# Altium project ps2-blueretro.PrjPcb
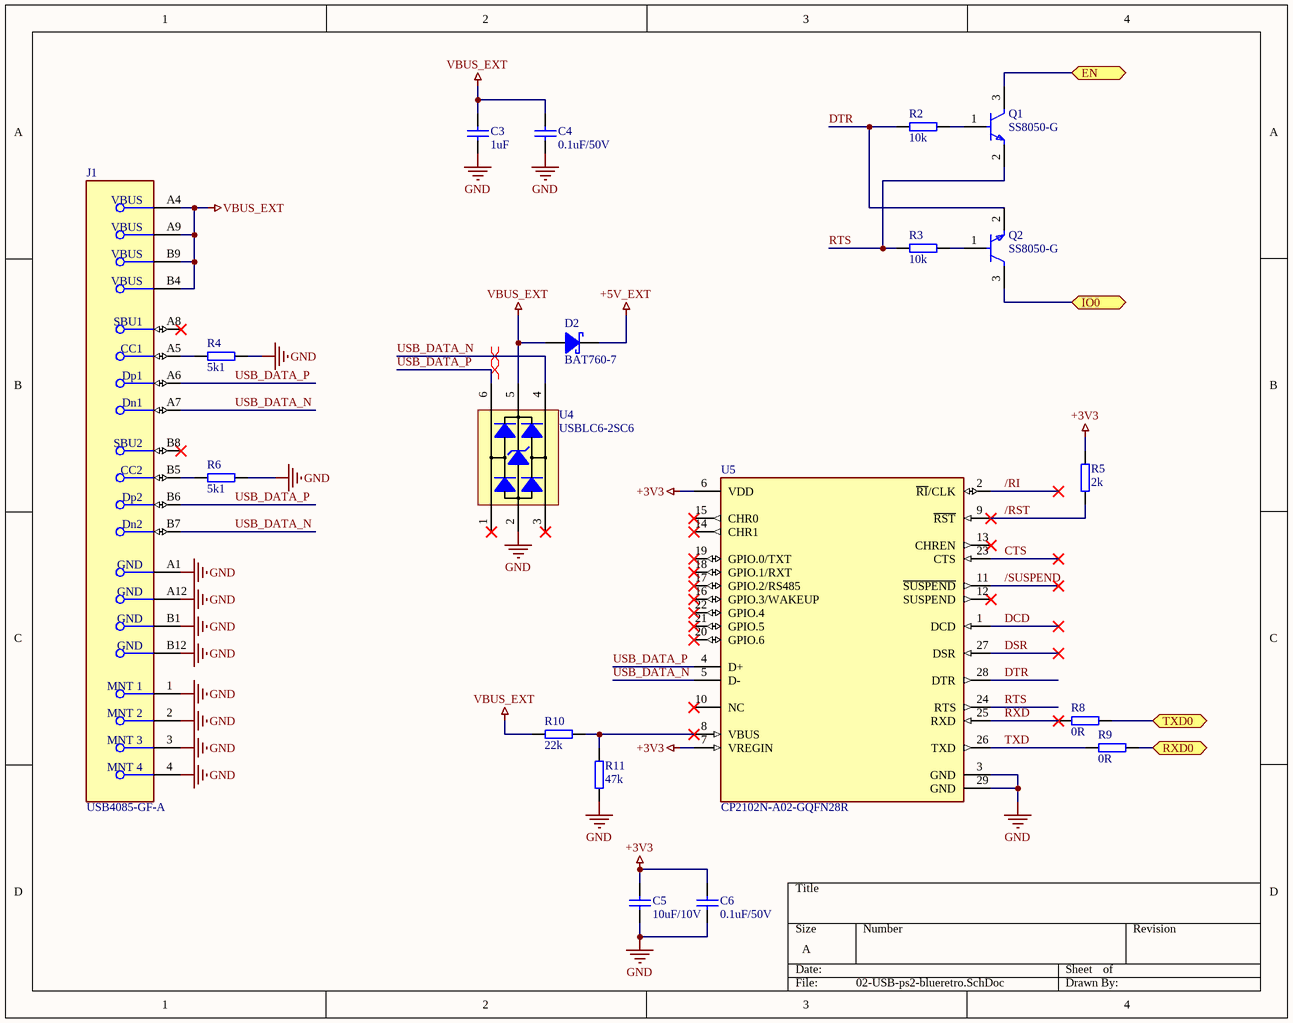
[diagram p0: 02-USB-ps2-blueretro.SchDoc]
7 sheets, 65 parts. Net scope: hierarchical (ports join the sheet entries above them; power ports are global).
Board file: ps2-blueretro.PcbDoc
Sheets:
  02-USB-ps2-blueretro.SchDoc
  00-ps2-blueretro.SchDoc
    U_01-ESP32-ps2-blueretro = 01-ESP32-ps2-blueretro.SchDoc
  03-PSU-ps2-blueretro.SchDoc
  04-CTRL1-ps2-blueretro.SchDoc
  05-CTRL2-ps2-blueretro.SchDoc
  06-DETECT-ps2-blueretro.SchDoc

## Sheet 02-USB-ps2-blueretro.SchDoc
size A; SheetNumber: 3; SheetTotal: 7

### Parts
(Parts that share a designator on the sheet are numbered #1, #2 ... from top to bottom, then left to right.)
C3#1  value 1uF  [cap_0603]  (hidden comment: cap_0603)
C4#1  value 0.1uF/50V  [cap_0603]  (hidden comment: cap_0603)
C5#1  value 10uF/10V  [cap_0603]  (hidden comment: cap_0603)
C6#1  value 0.1uF/50V  [cap_0603]  (hidden comment: cap_0603)
D2  BAT760-7  [sod-323]
J1  USB4085-GF-A  [FP-USB4085-GF-A-MFG]
Q1  SS8050-G  [FP-SS8050-G-MFG]
Q2  SS8050-G  [FP-SS8050-G-MFG]
R2#1  value 10k  [res_0603]  (hidden comment: res_0603)
R3#1  value 10k  [res_0603]  (hidden comment: res_0603)
R4#1  value 5k1  [res_0603]  (hidden comment: res_0603)
R5  value 2k  [res_0603]  (hidden comment: res_0603)
R6  value 5k1  [res_0603]  (hidden comment: res_0603)
R8  value 0R  [res_0603]  (hidden comment: res_0603)
R9  value 0R  [res_0603]  (hidden comment: res_0603)
R10  value 22k  [res_0603]  (hidden comment: res_0603)
R11  value 47k  [res_0603]  (hidden comment: res_0603)
U4  USBLC6-2SC6  [sot23-6l]
U5  CP2102N-A02-GQFN28R  [FP-CP2102N-A02-GQFN28R-MFG]

### Ports
EN (bidir, see 00-ps2-blueretro[3C], 01-ESP32-ps2-blueretro[3B]), IO0 (bidir, see 00-ps2-blueretro[3C], 01-ESP32-ps2-blueretro[1A]), RXD0 (bidir, see 00-ps2-blueretro[3B], 01-ESP32-ps2-blueretro[2B]), TXD0 (bidir, see 00-ps2-blueretro[3C], 01-ESP32-ps2-blueretro[2B])

### Nets
+3V3: C5#1.2 C6#1.2 R5.1 U5.6(VDD) U5.7(VREGIN)
+5V_EXT: D2.1(K)
GND: C3#1.1 C4#1.1 C5#1.1 C6#1.1 J1.1(MNT_1) J1.2(MNT_2) J1.3(MNT_3) J1.4(MNT_4) J1.A1(GND) J1.A12(GND) J1.B1(GND) J1.B12(GND) R4#1.1 R6.1 R11.2 U4.2 U5.3(GND) U5.29(GND)
VBUS_EXT: C3#1.2 C4#1.2 D2.2(A) J1.A4(VBUS) J1.A9(VBUS) J1.B4(VBUS) J1.B9(VBUS) R10.2 U4.5
/RI: U5.2(~{RI}/CLK)
/RST: R5.2 U5.9(~{RST})
/SUSPEND: U5.11(~{SUSPEND})
CTS: U5.23(CTS)
DCD: U5.1(DCD)
DSR: U5.27(DSR)
DTR: Q2.2(E) R2#1.1 U5.28(DTR)
RTS: Q1.2(E) R3#1.1 U5.24(RTS)
RXD: R8.2 U5.25(RXD)
TXD: R9.2 U5.26(TXD)
USB_DATA_N: J1.A7(Dn1) J1.B7(Dn2) U4.4 U5.5(D-)
USB_DATA_P: J1.A6(Dp1) J1.B6(Dp2) U4.6 U5.4(D+)
NetJ1_A5: J1.A5(CC1) R4#1.2
NetJ1_B5: J1.B5(CC2) R6.2
NetQ1_1: Q1.1(B) R2#1.2
NetQ1_3: Q1.3(C) ; port EN
NetQ2_1: Q2.1(B) R3#1.2
NetQ2_3: Q2.3(C) ; port IO0
NetR8_1: R8.1 ; port TXD0
NetR9_1: R9.1 ; port RXD0
NetR10_1: R10.1 R11.1 U5.8(VBUS)

Not connected (* = marked no-connect by the designer): J1 A8(SBU1)* B8(SBU2)*; U4 1* 3*; U5 10(NC)* 12(SUSPEND)* 13(CHREN)* 14(CHR1)* 15(CHR0)* 16(GPIO.3/WAKEUP)* 17(GPIO.2/RS485)* 18(GPIO.1/RXT)* 19(GPIO.0/TXT)* 20(GPIO.6)* 21(GPIO.5)* 22(GPIO.4)*

### Layout directives
differential pair: USB_DATA_N, USB_DATA_P

### Library data of the parts
D2 = BAT760-7: 30V 1A, Vf=495mV @ 1A, Ir=50µA @ 15V Schottky Diode; Manufacturer: Diodes Incorporated; Supplier: Digikey; Price: 0,48; Manufacturer Part Number: BAT760-7; Supplier Part Number: BAT760DICT-ND; ComponentLink1Description: Supplier Link; ComponentLink1URL: https://www.digikey.at/de/products/detail/diodes-incorporated/BAT760-7/697106; ComponentLink2Description: Manufacturer Link; ComponentLink2URL: *; ComponentLink3Description: Datasheet Link; ComponentLink3URL: https://www.diodes.com/assets/Datasheets/BAT760.pdf
J1 = CMP-196119-000001-2: CONN RCPT USB2.0 TYPE C 24POS RA; Gender: Receptacle; Number of Positions: 16; USB Standard: USB 2.0; Orientation: Right Angle; Contact Plating: Gold; Contact Material: Copper Alloy
Q1 Q2 = CMP-20235-000001-1: NPN TRANSISTOR 1.5A 40V SOT-23 R; Transition Frequency: 100MHz; Max Breakdown Voltage: 25V; Collector Emitter Voltage (VCEO): 400mV; Max Power Dissipation: 300mW; Max Collector Current: 1.5A; Case/Package: TO-236-3; Packaging: Tape and Reel; RoHS Compliant: Yes; Mount: Surface Mount; Collector Emitter Breakdown Voltage: 25V
U4 = USBLC6-2SC6: 2.5V 5A, Vf=1.1V @ 10mA, Ir=6µA @ 2.5V ESD Protection Diode; Manufacturer: STMicroelectronics; Supplier: Digikey; Price: 0,32; Manufacturer Part Number: USBLC6-2SC6; Supplier Part Number: 497-5235-1-ND; ComponentLink1Description: Supplier Link; ComponentLink1URL: https://www.digikey.at/de/products/detail/stmicroelectronics/USBLC6-2SC6/1040559; ComponentLink2Description: Manufacturer Link; ComponentLink2URL: *; ComponentLink3Description: Datasheet Link; ComponentLink3URL: https://www.st.com/content/ccc/resource/technical/document/datasheet/06/1d/48/9c/6c/20/4a/b2/CD00050750.pdf/files/CD00050750.pdf/jcr:content/translations/en.CD00050750.pdf
U5 = CMP-08093-000007-1: IC USB TO UART BRIDGE QFN28

## Sheet 00-ps2-blueretro.SchDoc
size A; SheetNumber: 1; SheetTotal: 5
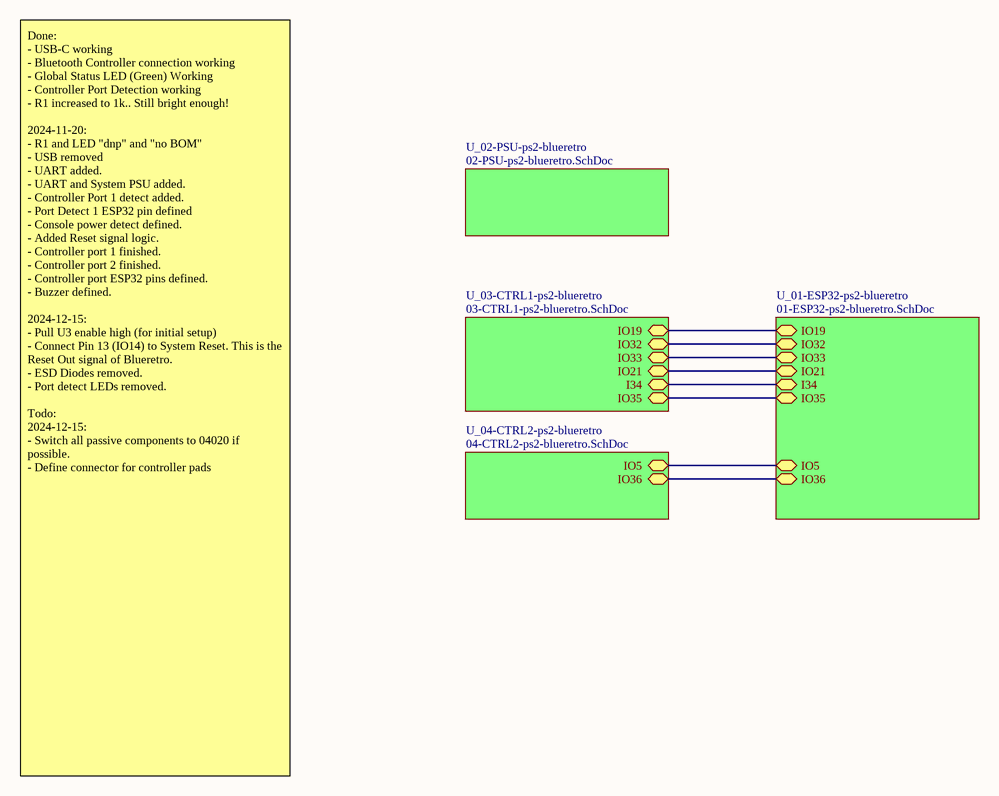
[diagram p1: 00-ps2-blueretro.SchDoc]

### Sub-sheets
U_01-ESP32-ps2-blueretro = 01-ESP32-ps2-blueretro.SchDoc: IO19 (bidir), IO32 (bidir), I34 (bidir), IO33 (bidir), IO21 (bidir), IO35 (bidir), IO5 (bidir), IO36 (bidir)
U_02-PSU-ps2-blueretro = 02-PSU-ps2-blueretro.SchDoc (file not in this document): no entries
U_03-CTRL1-ps2-blueretro = 03-CTRL1-ps2-blueretro.SchDoc (file not in this document): IO19 (bidir), IO32 (bidir), IO33 (bidir), IO21 (bidir), I34 (bidir), IO35 (bidir)
U_04-CTRL2-ps2-blueretro = 04-CTRL2-ps2-blueretro.SchDoc (file not in this document): IO5 (bidir), IO36 (bidir)

### Nets
IO22: sheet U_01-ESP32-ps2-blueretro/IO19, sheet U_03-CTRL1-ps2-blueretro/IO19
IO25: sheet U_01-ESP32-ps2-blueretro/IO21, sheet U_03-CTRL1-ps2-blueretro/IO21
IO26: sheet U_01-ESP32-ps2-blueretro/IO33, sheet U_03-CTRL1-ps2-blueretro/IO33
IO27: sheet U_01-ESP32-ps2-blueretro/IO32, sheet U_03-CTRL1-ps2-blueretro/IO32
NetU1_4: sheet U_01-ESP32-ps2-blueretro/IO36, sheet U_04-CTRL2-ps2-blueretro/IO36
NetU1_6: sheet U_01-ESP32-ps2-blueretro/I34, sheet U_03-CTRL1-ps2-blueretro/I34
NetU1_7: sheet U_01-ESP32-ps2-blueretro/IO35, sheet U_03-CTRL1-ps2-blueretro/IO35
NetU1_29: sheet U_01-ESP32-ps2-blueretro/IO5, sheet U_04-CTRL2-ps2-blueretro/IO5

### Notes on the sheet
- Done:
  - USB-C working
  - Bluetooth Controller connection working
  - Global Status LED (Green) Working
  - Controller Port Detection working
  - R1 increased to 1k.. Still bright enough!
  2024-11-20:
  - R1 and LED "dnp" and "no BOM"
  - USB removed
  - UART added.
  - UART and System PSU added.
  - Controller Port 1 detect added.
  - Port Detect 1 ESP32 pin defined
  - Console power detect defined.
  - Added Reset signal logic.
  - Controller port 1 finished.
  - Controller port 2 finished.
  - Controller port ESP32 pins defined.
  - Buzzer defined.
  2024-12-15:
  - Pull U3 enable high (for initial setup)
  - Connect Pin 13 (IO14) to System Reset. This is the Reset Out signal of Blueretro.
  - ESD Diodes removed.
  - Port detect LEDs removed.
  Todo:
  2024-12-15:
  - Switch all passive components to 04020 if possible.
  - Define connector for controller pads

## Sheet 01-ESP32-ps2-blueretro.SchDoc
size A4; SheetNumber: 2; SheetTotal: 6
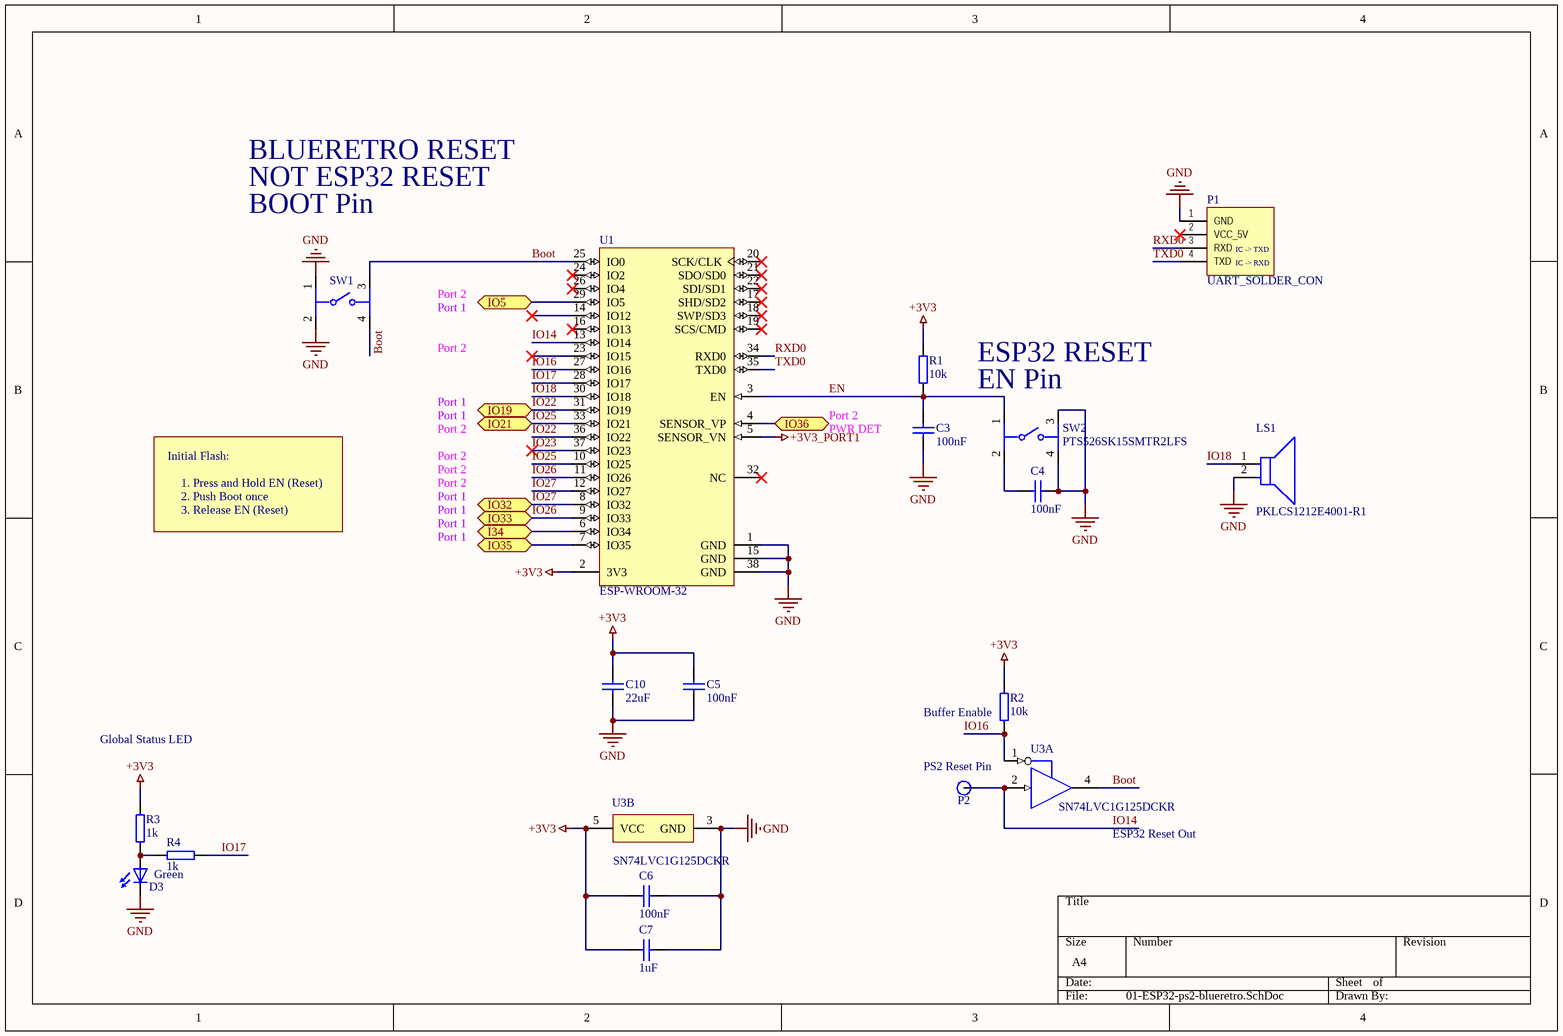
[diagram p2: 01-ESP32-ps2-blueretro.SchDoc]

### Parts
(Parts that share a designator on the sheet are numbered #1, #2 ... from top to bottom, then left to right.)
C3#2  value 100nF  [res_0402]  (hidden comment: cap_0402)
C4#2  value 100nF  [res_0402]  (hidden comment: cap_0402)
C5#2  value 100nF  [res_0402]  (hidden comment: cap_0402)
C6#2  value 100nF  [res_0402]  (hidden comment: cap_0402)
C7  value 1uF  [res_0402]  (hidden comment: cap_0402)
C10  value 22uF  [cap_0603]  (hidden comment: cap_0603)
D3  value Green  [led0603_GREEN]  (hidden comment: led_0603)
LS1  PKLCS1212E4001-R1  [FP-PKLCS1212E4001-R1-MFG]
P1  UART_SOLDER_CON  [UART_SOLDER_CON]  (no BOM)
P2  Solder_Contact_2mm  [SINGLE_SOLDER_CON]  (value not drawn)
R1#1  value 10k  [res_0402]  (hidden comment: res_0402)
R2#2  value 10k  [res_0402]  (hidden comment: res_0402)
R3#2  value 1k  [res_0402]  (hidden comment: res_0402)
R4#2  value 1k  [res_0402]  (hidden comment: res_0402)
SW1  PTS526SK15SMTR2LFS  [FP-PTS526SK15SMTR2LFS-MFG]  (value not drawn)
SW2  PTS526SK15SMTR2LFS  [FP-PTS526SK15SMTR2LFS-MFG]
U1  ESP-WROOM-32  [OLMX-ESP-WROOM-32]
U3  SN74LVC1G125DCKR  [DCK0005A_M]  (parts A,B of 2)

### Ports
I34 (bidir, see 00-ps2-blueretro[3B], 03-CTRL1-ps2-blueretro[2B]), IO5 (bidir, see 00-ps2-blueretro[3C], 04-CTRL2-ps2-blueretro[2B]), IO19 (bidir, see 00-ps2-blueretro[3B], 03-CTRL1-ps2-blueretro[2A]), IO21 (bidir, see 00-ps2-blueretro[3B], 03-CTRL1-ps2-blueretro[2B]), IO32 (bidir, see 00-ps2-blueretro[3B], 03-CTRL1-ps2-blueretro[2A]), IO33 (bidir, see 00-ps2-blueretro[3B], 03-CTRL1-ps2-blueretro[2B]), IO35 (bidir, see 00-ps2-blueretro[3B], 03-CTRL1-ps2-blueretro[2C]), IO36 (bidir, see 00-ps2-blueretro[3C], 04-CTRL2-ps2-blueretro[2C])

### Nets
+3V3: C5#2.2 C6#2.2 C7.2 C10.2 R1#1.2 R2#2.2 R3#2.2 U1.2(3V3) U3.5(VCC)
+3V3_PORT1: U1.5(SENSOR_VN)
GND: C3#2.2 C4#2.2 C5#2.1 C6#2.1 C7.1 C10.1 D3.2(C) LS1.2 P1.1(GND) SW1.1 SW1.2 SW2.3 SW2.4 U1.1(GND) U1.15(GND) U1.38(GND) U3.3(GND)
Boot: SW1.3 SW1.4 U1.25(IO0) U3.4(Y)
EN: C3#2.1 R1#1.1 SW2.1 U1.3(EN)
IO14: P2.1 U1.13(IO14) U3.2(A)
IO16: R2#2.1 U1.27(IO16) U3.1(~{OE})
IO17: R4#2.1 U1.28(IO17)
IO18: LS1.1 U1.30(IO18)
IO22: U1.31(IO19) U1.36(IO22) ; port IO19
IO23: U1.37(IO23)
IO25: U1.10(IO25) U1.33(IO21) ; port IO21
IO26: U1.9(IO33) U1.11(IO26) ; port IO33
IO27: U1.8(IO32) U1.12(IO27) ; port IO32
RXD0: P1.3(RXD) U1.34(RXD0)
TXD0: P1.4(TXD) U1.35(TXD0)
NetC4#2_1: C4#2.1 SW2.2
NetD3_1: D3.1(A) R3#2.1 R4#2.2
NetU1_4: U1.4(SENSOR_VP) ; port IO36
NetU1_6: U1.6(IO34) ; port I34
NetU1_7: U1.7(IO35) ; port IO35
NetU1_29: U1.29(IO5) ; port IO5

Not connected (* = marked no-connect by the designer): P1 2(VCC_5V)*; U1 14(IO12)* 16(IO13)* 17(SHD/SD2)* 18(SWP/SD3)* 19(SCS/CMD)* 20(SCK/CLK)* 21(SDO/SD0)* 22(SDI/SD1)* 23(IO15)* 24(IO2)* 26(IO4)* 32(NC)*

### Notes on the sheet
- BLUERETRO RESET
- BOOT Pin
- NOT ESP32 RESET
- Port 1
- Port 2
- ESP32 RESET
- PWR DET
- EN Pin
- Initial Flash:
- 1. Press and Hold EN (Reset)
- 2. Push Boot once
- 3. Release EN (Reset)
- (near R2#2) Buffer Enable
- Global Status LED
- (near P2) PS2 Reset Pin
- ESP32 Reset Out
- (in symbol UART_SOLDER_CON) IC -> TXD; IC -> RXD

### Library data of the parts
D3 = led_0603: Green 3,2V 20mA; Manufacturer: Würth Elektronik; Manufacturer Part Number: 150060GS75000; Supplier: Digikey; Price: 0,14; Supplier Part Number: 732-4971-1-ND; ComponentLink1Description: Supplier Link; ComponentLink1URL: https://www.digikey.at/de/products/detail/w%C3%BCrth-elektronik/150060GS75000/4489898; ComponentLink2Description: Manufacturer Link; ComponentLink2URL: *; ComponentLink3Description: Datasheet Link; ComponentLink3URL: https://www.we-online.com/components/products/datasheet/150060GS75000.pdf
LS1 = CMP-2000-05277-2: AUDIO PIEZO TRANSDUCER 25V SMD; Self Resonant Frequency: 4kHz; Nominal Input Voltage: 3V; Washable: No; Diameter: 12mm; Min Operating Temperature: -20°C; Lead Free: Lead Free; Voltage Rating: 25V; Radiation Hardening: No; Max Supply Voltage: 25V; Package Quantity: 1; Max Frequency: 4kHz; Width: 12mm; Voltage Rating (DC): 25V; Packaging: Tape and Reel; Max Operating Temperature: 70°C; Frequency: 4kHz; Length: 12mm; Height: 3mm; Termination: Solder; REACH SVHC: No SVHC; Depth: 12mm; Mount: Surface Mount
SW1 SW2 = CMP-10040-000013-1: TACT 5.2 X 5.2, 1.5 MM H, 260GF,; Manufacturer: C&K; Operating Force: 250gf; Throw Configuration: SPST-NO; Contact Current Rating: 50mA; Standoff Height: 0mm; Contact Resistance: 100mΩ; Voltage Rating Dc: 12V; Electromechanical Life: 200000Cycles; Device Class L3: Tactile Switches; Device Class L2: Switches; Temperature: -20°C to +70°C; Temperature Range Low: -20°C; Package: PTS526SK15SMTR2LFS; Temperature Range High: +70°C; ComponentLink2Description: Datasheet; Device Class L1: Electromechanical; Height: 1.65mm; Digikey Description: TACT 5.2 X 5.2, 1.5 MM H, 260GF,; Category: Switch; RoHS: TRUE; Automotive: No; Lead Free: Yes; Manufacturer Part Number: PTS526SK15SMTR2LFS; Octopart: https://octopart.com/pts526+sk15+smtr2+lfs-c%26k+components-100617999; ComponentLink2URL: https://www.ckswitches.com/media/2780/pts526.pdf
U1 = CMP-2000-07454-1: Espressif System, 2.7 to 3.6 V, -40 to 85 degC, 38-Pin SMD; Manufacturer: Olimex; Package Description: 38-Pin Surface Mount Device, Body 18 x 25.5 mm, Pitch 1.27 mm; Manufacturer URL: https://www.olimex.com; RoHSCompliant: false; Mounting Technology: SurfaceMount; Datasheet Version: Rev. 2.1, 09/2017; Datasheet URL: http://www.espressif.com/sites/default/files/documentation/esp-wroom-32_datasheet_en.pdf; Package Reference: ESP-WROOM-32
U3 = CMP-0859-00281-3: Single Bus Buffer Gate With 3-State Outputs, DCK0005A, LARGE T&R; Manufacturer: Texas Instruments; Bits(#): 1; tpd @ Nom Voltage(Max)(ns): 9,5.5,4.5,4; 3-State Output: Yes; Output Type: CMOS; Sub-Family: Non-Inverting Buffer/Driver; Logic: True; Output Drive (IOL/IOH)(Max)(mA): 32/-32; Voltage(Nom)(V): 1.8,2.5,3.3,5; ICC @ Nom Voltage(Max)(mA): 0.01; Technology Family: LVC; VCC(Min)(V): 1.65; VCC(Max)(V): 5.5; F @ Nom Voltage(Max)(Mhz): 150; Rating: Catalog; Input Type: CMOS/TTL; Schmitt Trigger: No; PackageReference: DCK0005A; Generic Part Number: SN74LVC1G125; DatasheetVersion: SCES223T; Operating Temperature Range(C): -40 to 125,-40 to 85

## Sheet 03-PSU-ps2-blueretro.SchDoc
size A; SheetNumber: 4; SheetTotal: 7
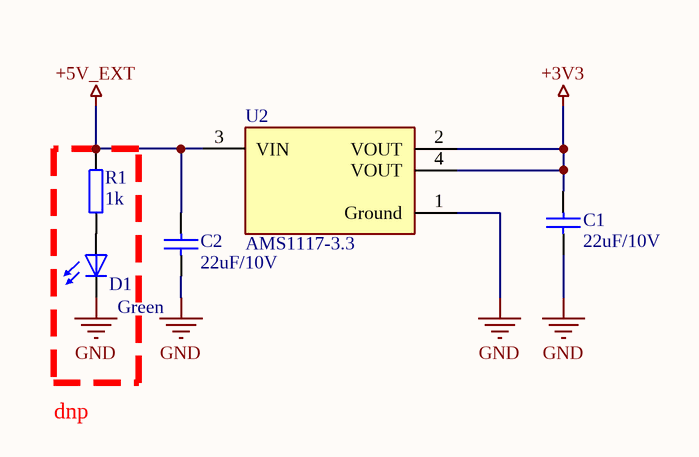
[diagram p3: 03-PSU-ps2-blueretro.SchDoc]

### Parts
(Parts that share a designator on the sheet are numbered #1, #2 ... from top to bottom, then left to right.)
C1  value 22uF/10V  [cap_0603]  (hidden comment: cap_0603)
C2  value 22uF/10V  [cap_0603]  (hidden comment: cap_0603)
D1  value Green  [led0603_GREEN]  (hidden comment: led_0603)  (no BOM)
R1#2  value 1k  [res_0603]  (hidden comment: res_0603)  (no BOM)
U2  AMS1117-3.3  [FP-AMS1117-IPC_C]

### Nets
+3V3: C1.2 U2.2(VOUT) U2.4(VOUT)
+5V_EXT: C2.2 R1#2.2 U2.3(VIN)
GND: C1.1 C2.1 D1.2(C) U2.1(Ground)
NetD1_1: D1.1(A) R1#2.1

### Notes on the sheet
- dnp

### Library data of the parts
D1 = led_0603: as D3 on sheet 01-ESP32-ps2-blueretro; Supplier: Digikey; Price: 0,14; Supplier Part Number: 732-4971-1-ND; ComponentLink1Description: Supplier Link; ComponentLink1URL: https://www.digikey.at/de/products/detail/w%C3%BCrth-elektronik/150060GS75000/4489898; ComponentLink2Description: Manufacturer Link; ComponentLink2URL: *; ComponentLink3Description: Datasheet Link; ComponentLink3URL: https://www.we-online.com/components/products/datasheet/150060GS75000.pdf
U2 = CMP-209535-000001-1: LDO Voltage Regulators 1A, 3.3V; Manufacturer: Advanced Monolithic Systems; Dropout Voltage: 1.1V; Output Type: Fixed; Nominal Supply Current: 5mA; Max Power Dissipation: 1.2W; Max Supply Voltage: 15V; Number Of Outputs: 1; Standoff Height: 0.64mm; Max Junction Temp: +125°C; Height: 1.8mm; Package: AMS1117; Device Class L2: Power Management ICs; ComponentLink2Description: Datasheet; ComponentLink2URL: http://www.advanced-monolithic.com/pdf/ds1117.pdf; Category: IC; RoHS: TRUE; Automotive: No; Device Class L1: Integrated Circuits (ICs); Output Current: 1A; Device Class L3: Voltage Regulators - Linear; Temperature: -40°C to +125°C; Output Voltage: 3.3V; Manufacturer Part Number: AMS1117-3.3; Temperature Range Low: -40°C; Octopart: https://octopart.com/ams1117-3.3-advanced+monolithic+systems-25899300; Lead Free: Yes; Ipc Land Pattern Name: SOT229P700X180-4; Temperature Range High: +125°C

## Sheet 04-CTRL1-ps2-blueretro.SchDoc
size A; SheetNumber: 5; SheetTotal: 7
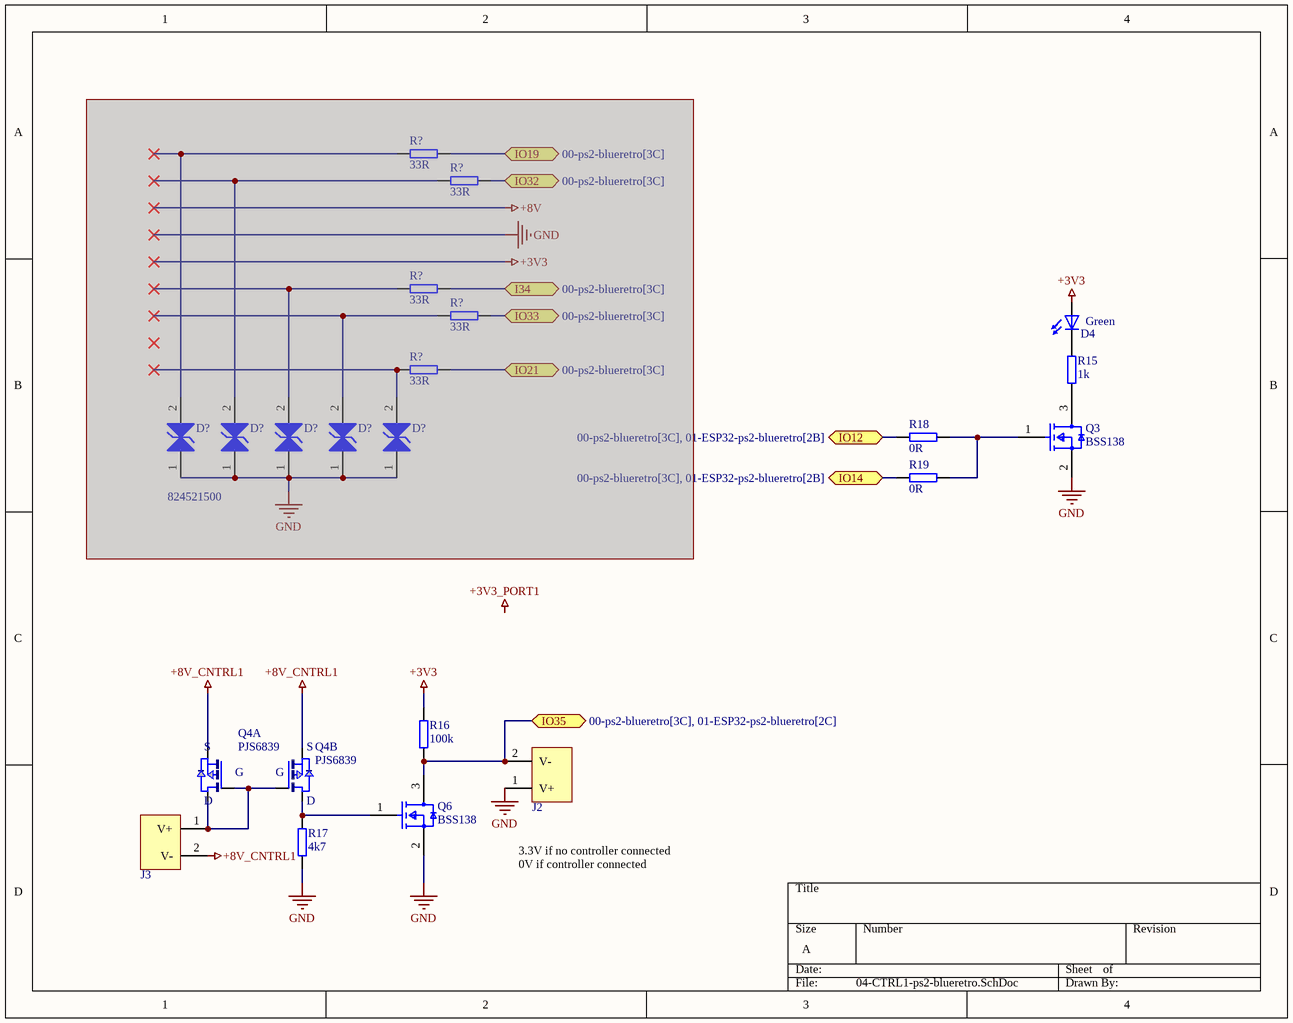
[diagram p4: 04-CTRL1-ps2-blueretro.SchDoc]

### Parts
(Parts that share a designator on the sheet are numbered #1, #2 ... from top to bottom, then left to right.)
D4  value Green  [led0603_GREEN]  (hidden comment: led_0603)
D?#1  824521500  [WE-TVSP_DO-214AA_Bidirectional]  (masked out: inside a compile mask, not in the netlist)
D?#2  824521500  [WE-TVSP_DO-214AA_Bidirectional]  (value not drawn)  (masked out: inside a compile mask, not in the netlist)
D?#3  824521500  [WE-TVSP_DO-214AA_Bidirectional]  (value not drawn)  (masked out: inside a compile mask, not in the netlist)
D?#4  824521500  [WE-TVSP_DO-214AA_Bidirectional]  (value not drawn)  (masked out: inside a compile mask, not in the netlist)
D?#5  824521500  [WE-TVSP_DO-214AA_Bidirectional]  (value not drawn)  (masked out: inside a compile mask, not in the netlist)
J2  2 Pole 2.54mm  [2.54mm_2pole]  (value not drawn)  (no BOM)
J3  2 Pole 2.54mm  [2.54mm_2pole]  (value not drawn)  (no BOM)
Q3  BSS138  [FP-318-08-IPC_B]
Q4  PJS6839  [SOT23-6]  (parts A,B of 2)
Q6  BSS138  [FP-318-08-IPC_B]
R15  value 1k  [res_0603]  (hidden comment: res_0603)
R16  value 100k  [res_0603]  (hidden comment: res_0603)
R17  value 4k7  [res_0603]  (hidden comment: res_0603)
R18  value 0R  [res_0603]  (hidden comment: res_0603)
R19  value 0R  [res_0603]  (hidden comment: res_0603)
R?#1  value 33R  [res_0603]  (hidden comment: res_0603)  (masked out: inside a compile mask, not in the netlist)
R?#2  value 33R  [res_0603]  (hidden comment: res_0603)  (masked out: inside a compile mask, not in the netlist)
R?#3  value 33R  [res_0603]  (hidden comment: res_0603)  (masked out: inside a compile mask, not in the netlist)
R?#4  value 33R  [res_0603]  (hidden comment: res_0603)  (masked out: inside a compile mask, not in the netlist)
R?#5  value 33R  [res_0603]  (hidden comment: res_0603)  (masked out: inside a compile mask, not in the netlist)

### Ports
I34 (bidir, see 00-ps2-blueretro[3C]), IO12 (bidir, see 00-ps2-blueretro[3C], 01-ESP32-ps2-blueretro[2B]), IO14 (bidir, see 00-ps2-blueretro[3C], 01-ESP32-ps2-blueretro[2B]), IO19 (bidir, see 00-ps2-blueretro[3C]), IO21 (bidir, see 00-ps2-blueretro[3C]), IO32 (bidir, see 00-ps2-blueretro[3C]), IO33 (bidir, see 00-ps2-blueretro[3C]), IO35 (bidir, see 00-ps2-blueretro[3C], 01-ESP32-ps2-blueretro[2C])

### Nets
+3V3: D4.1(A) R16.2
+8V_CNTRL1: J3.2(V-) Q4.2(S2) Q4.5(S1)
GND: J2.1(V+) Q3.2(S) Q6.2(S) R17.1
NetD4_2: D4.2(C) R15.2
NetJ2_2: J2.2(V-) Q6.3(D) R16.1 ; port IO35
NetJ3_1: J3.1(V+) Q4.1(G1) Q4.3(G2) Q4.6(D1)
NetQ3_1: Q3.1(G) R18.1 R19.1
NetQ3_3: Q3.3(D) R15.1
NetQ4_4: Q4.4(D2) Q6.1(G) R17.2
NetR18_2: R18.2 ; port IO12
NetR19_2: R19.2 ; port IO14

### Notes on the sheet
- 3.3V if no controller connected
  0V if controller connected
- Labels drawn without touching a wire or pin: +3V3_PORT1
- (in symbol PJS6839, part A) S; G; D
- (in symbol PJS6839, part B) S; G; D

### Library data of the parts
D4 = led_0603: as D3 on sheet 01-ESP32-ps2-blueretro; Supplier: Digikey; Price: 0,14; Supplier Part Number: 732-4971-1-ND; ComponentLink1Description: Supplier Link; ComponentLink1URL: https://www.digikey.at/de/products/detail/w%C3%BCrth-elektronik/150060GS75000/4489898; ComponentLink2Description: Manufacturer Link; ComponentLink2URL: *; ComponentLink3Description: Datasheet Link; ComponentLink3URL: https://www.we-online.com/components/products/datasheet/150060GS75000.pdf
D?#1-D?#5 = CMP-03913-71101632-1: 824521500 Tvs Diode, 600W, 5V, Bidir, DO-214AA; Leakage Current: 1.6mA; Clamping Voltage: 9.2V; Max Breakdown Voltage: 6.7V; Power Line Protection: No; Peak Pulse Current: 65.3A; Number of Bidirectional Channels: 1; Polarity: Bidirectional; Length: 4.32mm; Reverse Standoff Voltage: 5V; Number of Pins: 2; Peak Pulse Power: 600W; Height: 2.4mm; Width: 3.62mm; Min Operating Temperature: -65°C; REACH SVHC: Unknown; Breakdown Voltage: 6.7V; Min Breakdown Voltage: 6.7V; Max Operating Temperature: 150°C; Composition: Zener; Packaging: Cut Tape; NexarPartId: 71101632; Mount: Surface Mount; RoHS: Compliant
J2 J3 = 2 Pole 2.54mm: Solder contacts for a 2.54mm connector
Q3 Q6 = CMP-07173-000101-1: MOSFET N-CH 50V 220MA SOT-23; Turn-Off Delay Time: 20ns; Element Configuration: Single; Rds On Max: 3.5R; Gate to Source Voltage (Vgs): 20V; Threshold Voltage: 1.3V; Number of Elements: 1; Power Dissipation: 360mW; Rise Time: 9ns; Turn-On Delay Time: 2.5ns; Input Capacitance: 27pF; On-State Resistance: 6R; Lead Free: Lead Free; Length: 2.92mm; Width: 1.3mm; Drain to Source Breakdown Voltage: 50V; Min Operating Temperature: -55°C; REACH SVHC: No SVHC; Packaging: Tape and Reel; Radiation Hardening: No; Height: 0.93mm; Drain to Source Voltage (Vdss): 50V; Current Rating: 220mA; Voltage Rating (DC): 50V; Weight: 0.03g; Continuous Drain Current (ID): 220mA; Number of Pins: 3; Nominal Vgs: 1.3V; Max Power Dissipation: 360mW; Fall Time: 9ns; Drain to Source Resistance: 3.5R; Contact Plating: Tin; Case/Package: SOT-23; Package Quantity: 1; Dual Supply Voltage: 50V; Mount: Surface Mount; Termination: SMD/SMT; Max Operating Temperature: 150°C
Q4 = PJS6839: MOSFET P-CH 60V 300mA SOT-23-6; Manufacturer: Panjit International Inc.; Manufacturer Part Number: PJS6839_S1_00001; Supplier: Digikey; Supplier Part Number: 3757-PJS6839_S1_00001CT-ND; Price: 0.28; ComponentLink1Description: Datasheet; ComponentLink1URL: https://www.panjit.com.tw/upload/datasheet/PJS6839.pdf; ComponentLink2Description: Supplier; ComponentLink2URL: https://www.digikey.at/en/products/detail/panjit-international-inc/PJS6839-S1-00001/15799236; Value: PJS6839

## Sheet 05-CTRL2-ps2-blueretro.SchDoc
size A; SheetNumber: 6; SheetTotal: 6

## Sheet 06-DETECT-ps2-blueretro.SchDoc
size A; SheetNumber: 7; SheetTotal: 7
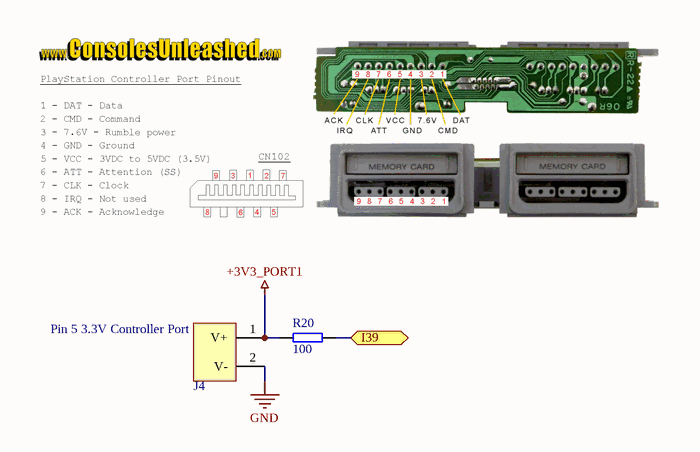
[diagram p5: 06-DETECT-ps2-blueretro.SchDoc]

### Parts
J4  2 Pole 2.54mm  [2.54mm_2pole]  (value not drawn)  (no BOM)
R20  value 100  [res_0603]  (hidden comment: res_0603)

### Ports
I39 (bidir, see 00-ps2-blueretro[3D], 01-ESP32-ps2-blueretro[2B])

### Nets
+3V3_PORT1: J4.1(V+) R20.2
GND: J4.2(V-)
NetR20_1: R20.1 ; port I39

### Notes on the sheet
- (near J4) Pin 5 3.3V Controller Port

### Library data of the parts
J4 = 2 Pole 2.54mm: Solder contacts for a 2.54mm connector

## Nets that join several sheets
+3V3: 02-USB-ps2-blueretro (5 pins), 01-ESP32-ps2-blueretro (9 pins), 03-PSU-ps2-blueretro (C1.2 U2.2 U2.4), 04-CTRL1-ps2-blueretro (D4.1 R16.2)
+3V3_PORT1: 01-ESP32-ps2-blueretro (U1.5), 06-DETECT-ps2-blueretro (J4.1 R20.2)
+5V_EXT: 02-USB-ps2-blueretro (D2.1), 03-PSU-ps2-blueretro (C2.2 R1#2.2 U2.3)
GND: 02-USB-ps2-blueretro (18 pins), 01-ESP32-ps2-blueretro (17 pins), 03-PSU-ps2-blueretro (C1.1 C2.1 D1.2 U2.1), 04-CTRL1-ps2-blueretro (J2.1 Q3.2 Q6.2 R17.1), 06-DETECT-ps2-blueretro (J4.2)